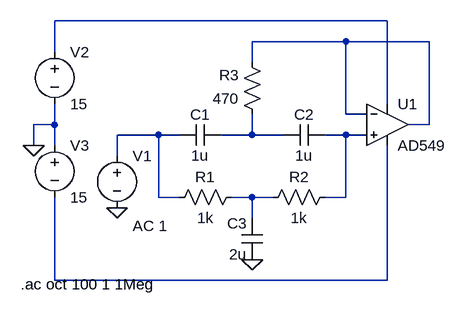
[diagram p0: schematic BandRejectFilter.asc]
BandRejectFilter.asc, the LTspice schematic file:
Version 4
SHEET 1 880 680
WIRE 416 16 -96 16
WIRE 352 48 208 48
WIRE 480 48 352 48
WIRE -96 64 -96 16
WIRE 208 80 208 48
WIRE 416 144 416 16
WIRE 352 160 352 48
WIRE 384 160 352 160
WIRE -96 176 -96 144
WIRE -96 176 -128 176
WIRE 480 176 480 48
WIRE 480 176 448 176
WIRE 64 192 0 192
WIRE 96 192 64 192
WIRE 208 192 208 160
WIRE 208 192 160 192
WIRE 256 192 208 192
WIRE 352 192 320 192
WIRE 384 192 352 192
WIRE -128 208 -128 176
WIRE -96 208 -96 176
WIRE 0 224 0 192
WIRE 64 288 64 192
WIRE 96 288 64 288
WIRE 208 288 176 288
WIRE 240 288 208 288
WIRE 352 288 352 192
WIRE 352 288 320 288
WIRE 208 320 208 288
WIRE -96 416 -96 288
WIRE 416 416 416 208
WIRE 416 416 -96 416
FLAG 208 384 0
FLAG 0 304 0
FLAG -128 208 0
SYMBOL Opamps\\AD549 416 112 R0
SYMATTR InstName U1
SYMBOL cap 160 176 R90
WINDOW 0 0 32 VBottom 2
WINDOW 3 32 32 VTop 2
SYMATTR InstName C1
SYMATTR Value 1u
SYMBOL cap 320 176 R90
WINDOW 0 0 32 VBottom 2
WINDOW 3 32 32 VTop 2
SYMATTR InstName C2
SYMATTR Value 1u
SYMBOL cap 224 384 R180
WINDOW 0 24 56 Left 2
WINDOW 3 24 8 Left 2
SYMATTR InstName C3
SYMATTR Value 2u
SYMBOL res 192 272 R90
WINDOW 0 0 56 VBottom 2
WINDOW 3 32 56 VTop 2
SYMATTR InstName R1
SYMATTR Value 1k
SYMBOL res 336 272 R90
WINDOW 0 0 56 VBottom 2
WINDOW 3 32 56 VTop 2
SYMATTR InstName R2
SYMATTR Value 1k
SYMBOL res 224 176 R180
WINDOW 0 36 76 Left 2
WINDOW 3 36 40 Left 2
SYMATTR InstName R3
SYMATTR Value 470
SYMBOL voltage 0 208 R0
WINDOW 123 24 124 Left 2
WINDOW 39 0 0 Left 0
SYMATTR Value2 AC 1
SYMATTR InstName V1
SYMATTR Value ""
SYMBOL voltage -96 48 R0
WINDOW 123 0 0 Left 0
WINDOW 39 0 0 Left 0
SYMATTR InstName V2
SYMATTR Value 15
SYMBOL voltage -96 192 R0
WINDOW 123 0 0 Left 0
WINDOW 39 0 0 Left 0
SYMATTR InstName V3
SYMATTR Value 15
TEXT -148 422 Left 2 !.ac oct 100 1 1Meg

The netlist it stands for:
* BandRejectFilter.asc
XU1 N005 N002 N001 N007 N002 AD549  ; pins In+ In- V+ V- OUT
C1 N004 N003 1u
C2 N005 N004 1u
C3 0 N006 2u
R1 N006 N003 1k
R2 N005 N006 1k
R3 N004 N002 470
V1 N003 0 AC 1
V2 N001 0 15
V3 0 N007 15
.ac oct 100 1 1Meg
.backanno
.end